# Altium schematic sheet RelesOut.SchDoc
size A4
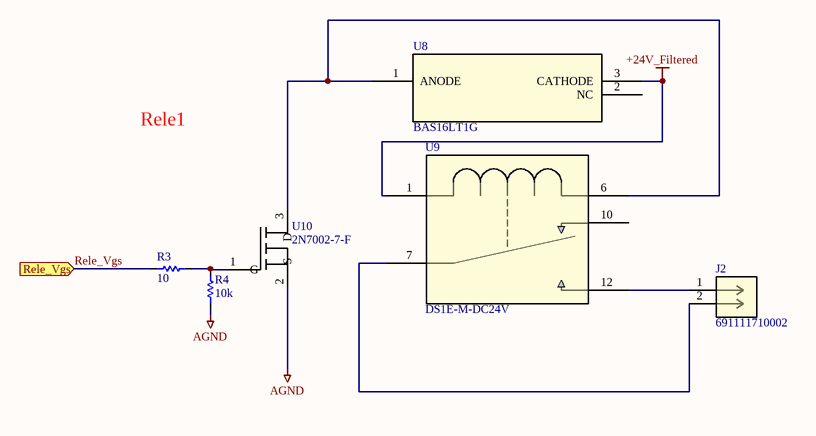
[diagram p0: RelesOut.SchDoc]

## Parts
J2  691111710002  [CONN2_710002_WRE]
R3  10  [RES_0805]
R4  10k  [RES_0805]
U8  BAS16LT1G  [SOT-23_ONS-M]
U9  DS1E-M-DC24V  [RELAY_DS1E_PAN]
U10  2N7002-7-F  [SOT-23_1_DIO]

## Ports
Rele_Vgs (in)

## Nets
+24V_Filtered: U8.3(CATHODE) U9.1
AGND: R4.1 U10.2(S)
Rele_Vgs: R3.2 ; port Rele_Vgs
NetJ2_1: J2.1 U9.12
NetJ2_2: J2.2 U9.7
NetR3_1: R3.1 R4.2 U10.1(G)
NetU8_1: U8.1(ANODE) U9.6 U10.3(D)

Not connected (* = marked no-connect by the designer): U8 2(NC); U9 10(4)

## Notes on the sheet
- Rele1

## Library data of the parts
J2 = 691111710002: No Description Available; Mfr_Name: Wurth Electronics; Copyright: Copyright (C) 2023 Ultra Librarian. All rights reserved.; Manufacturer_Part_Number: 691111710002; RefDes: RefDes; Type: DEV
R3 = Res_0805: 10 kOhms ±1% 0.125W, 1/8W Chip Resistor 0805 (2012 Metric) Automotive AEC-Q200 Thick Film; MF: Panasonic Electronic Components; MFP: ERJ-6ENF1002V; Value: 10k; Created: 2020_06_15_DAarancibia; Package: 0805; Supplier 1: Digi-Key; Supplier Part Number 1: P10.0KCCT-ND
R4 = Res_0805: 10 kOhms ±1% 0.125W, 1/8W Chip Resistor 0805 (2012 Metric) Automotive AEC-Q200 Thick Film; MF: Panasonic Electronic Components; MFP: ERJ-6ENF1002V; Created: 2020_06_15_DAarancibia; Package: 0805; Value: 10k; Supplier 1: Digi-Key; Supplier Part Number 1: P10.0KCCT-ND
U8 = BAS16LT1G: No Description Available; Mfr_Name: onsemi; Copyright: Copyright (C) 2023 Ultra Librarian. All rights reserved.; Manufacturer_Part_Number: BAS16LT1G; RefDes: RefDes; Type: DEV
U9 = DS1E-M-DC24V: No Description Available; Mfr_Name: Panasonic; Copyright: Copyright (C) 2023 Ultra Librarian. All rights reserved.; Manufacturer_Part_Number: DS1E-M-DC24V; RefDes: RefDes; Type: DEV
U10 = 2N7002-7-F: No Description Available; Mfr_Name: Diodes Inc; RefDes: RefDes; Type: Type